# Altium schematic sheet 19-Power-P5V.SchDoc
size B; SheetNumber: 19; SheetTotal: 20; SPICEModelCacheMWNZRPGN: <root> / <DocumentId>MWNZRPGN</DocumentId> / <CacheFrame Number="0"> / <Model Name="emk105bj105_v-f" Kind="CKT"> / <Text>* EMK105BJ105_V-F     SPICE MODEL  ( General Type ) / *-------------------------------------------------------------------------------------------------------- / * Model Generated by TAIYO YUDEN Corporation (http://www.ty-top.com) / * Version 1.0 / * TAIYO YUDEN Control No. 170508_130520 / * Copyright(c) 2012 TAIYO YUDEN CO.,LTD. All Rights Reserved. / *-------------------------------------------------------------------------------------------------------- / * / * Products Name : Multilayer Ceramic Capacitors / * / * Characteristics : / *     Capacitance : 1 uF , Rated Voltage : 16V , TCC : X5R / *     Case Size : 1.0 x 0.5 / 0.039 x 0.02 [mm/inch] , Thickness : 0.5 / 0.02 [mm/inch] / *     (Conditions: Temperature = 25 degC , DC Bias Current/Voltage = 0A / 0V) / * / * Frequency Range : 40Hz - 3GHz / * / * External Node Assignments : / * / *  1  o---| |---o  2 / * / *-------------------------------------------------------------------------------------------------------- / .SubCkt EMK105BJ105_V-F 1 2 / **************************** / C0 1 110 0.68309u / Cm 1 101 0.26053u / C1 101 102 0.94076u / Rc1 101 102 1.9029k / C2 102 103 0.66707u / Rc2 102 103 120.36 / C3 103 110 0.57203u / Rc3 103 110 2.1097 / C2m 1 301 0.1871u / C21 301 302 3.2494u / Rc21 301 302 1.1117k / C22 302 303 2.1014u / Rc22 302 303 1.484k / C23 303 304 2.1172u / Rc23 303 304 1.3876k / C24 304 305 0.75729u / Rc24 304 305 332.59 / C25 305 306 0.94401u / Rc25 305 306 249.09 / C26 306 307 0.34674u / Rc26 306 307 28.352 / C27 307 308 0.37158u / Rc27 307 308 19.989 / C28 308 309 0.17933u / Rc28 308 309 31.748 / C29 309 110 0.016445u / Rc29 309 110 1.0592 / Rp0 1 110 100Meg / L0 110 120 0.2216n / Lm 120 130 0.1509n / L1 120 121 0.12659n / RL1 121 130 0.85161 / L2 120 122 0.15996n / RL2 122 130 0.42469 / L3 120 123 7.9543n / RL3 123 130 0.54643m / CR 120 124 0.24334u / LR 124 125 0.090738n / RR 125 130 68.076m / CL 130 140 2.7354p / LL 130 140 0.10762n / RL 130 140 50.614 / Rs 140 2 7.5416m / **************************** / .ends EMK105BJ105_V-F</Text> / </Model> / </CacheFrame> / </root>
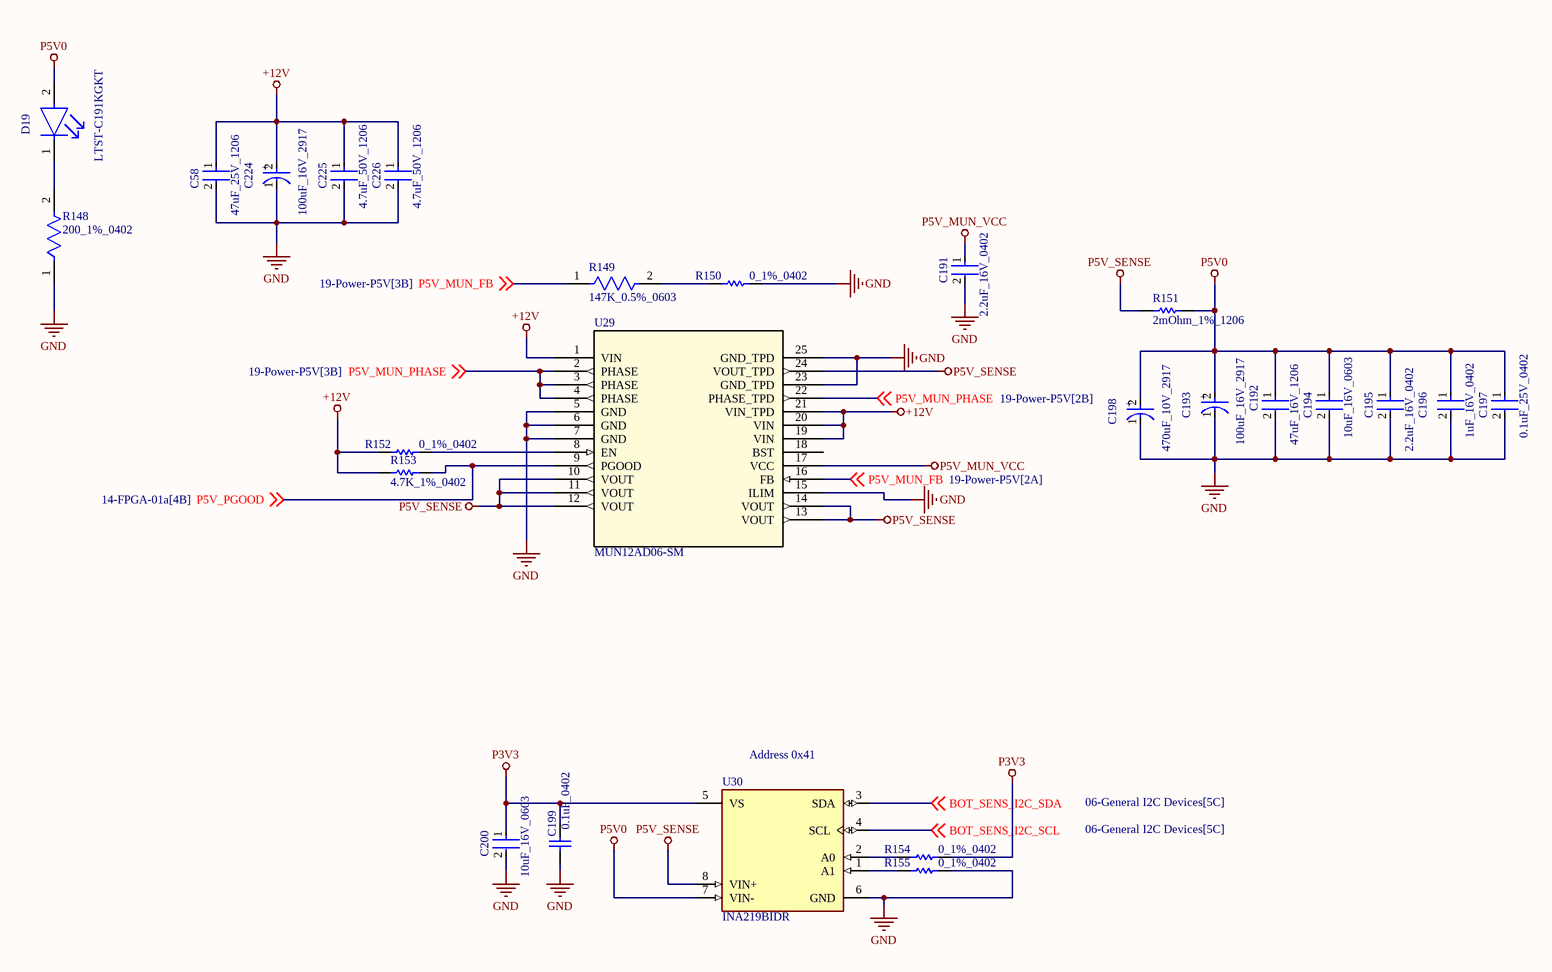
[diagram p0: 19-Power-P5V.SchDoc]

## Parts
C58  47uF_25V_1206  [FP-C3216-160-0_2-MFG]
C191  2.2uF_16V_0402  [FP-C1005-050-0_05-IPC_A]
C192  47uF_16V_1206  [FP-C3216-160-0_2-MFG]
C193  100uF_16V_2917  [FP-T495D107K016ATE125-MFG]
C194  10uF_16V_0603  [FP-0603-L_1_6_0_2-W_0_8_0-MFG]
C195  2.2uF_16V_0402  [FP-C1005-050-0_05-IPC_A]
C196  1uF_16V_0402  [FP-0402-L_1_0_0_05-W_0_5-IPC_A]
C197  0.1uF_25V_0402  [FP-0402-L_1_0_1-W_0_5_0_1-IPC_C]
C198  470uF_10V_2917  [FP-TAJE-MFG]
C199  0.1uF_0402  [CAPC1005X56X25NL10T15]
C200  10uF_16V_0603  [FP-0603-L_1_6_0_2-W_0_8_0-MFG]
C224  100uF_16V_2917  [FP-T495D107K016ATE125-MFG]
C225  4.7uF_50V_1206  [FP-GRM31C-0_2-e0_3_0_8-IPC_C]
C226  4.7uF_50V_1206  [FP-GRM31C-0_2-e0_3_0_8-IPC_C]
D19  LTST-C191KGKT  [FP-LTST-C191KGKT-MFG]
R148  200_1%_0402  [FP-ERJ2RK-IPC_A]
R149  147K_0.5%_0603  [FP-RR0816-IPC_C]
R150  0_1%_0402  [RESC1005X40X25LL05T05]
R151  2mOhm_1%_1206  [RESC3216X89X64NL25T25]
R152  0_1%_0402  [RESC1005X40X25LL05T05]
R153  4.7K_1%_0402  [RESC1005X40X25NL10T10]
R154  0_1%_0402  [RESC1005X40X25LL05T05]
R155  0_1%_0402  [RESC1005X40X25LL05T05]
U29  MUN12AD06-SM  [MUN12AD06-SM_CYN]
U30  INA219BIDR  [FP-D0008A-MFG]

## Nets
+12V: C58.1 C224.2(A) C225.1 C226.1 R152.1 R153.2 U29.1(VIN) U29.19(VIN) U29.20(VIN) U29.21(VIN_TPD)
GND: C58.2 C191.2 C192.2 C193.1(C) C194.2 C195.2 C196.2 C197.2 C198.1(C) C199.1 C200.2 C224.1(C) C225.2 C226.2 R148.1 R150.2 R155.2 U29.5(GND) U29.6(GND) U29.7(GND) U29.15(ILIM) U29.23(GND_TPD) U29.25(GND_TPD) U30.6(GND)
P3V3: C199.2 C200.1 R154.2 U30.5(VS)
P5V0: C192.1 C193.2(A) C194.1 C195.1 C196.1 C197.1 C198.2(A) D19.2(A) R151.2 U30.7(VIN-)
P5V_MUN_VCC: C191.1 U29.17(VCC)
P5V_SENSE: R151.1 U29.10(VOUT) U29.11(VOUT) U29.12(VOUT) U29.13(VOUT) U29.14(VOUT) U29.24(VOUT_TPD) U30.8(VIN+)
BOT_SENS_I2C_SCL: U30.4(SCL) ; off-sheet BOT_SENS_I2C_SCL
BOT_SENS_I2C_SDA: U30.3(SDA) ; off-sheet BOT_SENS_I2C_SDA
P5V_MUN_FB: R149.1 U29.16(FB) ; off-sheet P5V_MUN_FB
P5V_MUN_PHASE: U29.2(PHASE) U29.3(PHASE) U29.4(PHASE) U29.22(PHASE_TPD) ; off-sheet P5V_MUN_PHASE
P5V_PGOOD: R153.1 U29.9(PGOOD) ; off-sheet P5V_PGOOD
NetD19_1: D19.1(C) R148.2
NetR149_2: R149.2 R150.1
NetR152_2: R152.2 U29.8(EN)
NetR154_1: R154.1 U30.2(A0)
NetR155_1: R155.1 U30.1(A1)

Not connected (* = marked no-connect by the designer): U29 18(BST)

## Notes on the sheet
- (near U30) Address 0x41
- (in symbol CMP-2000-07207-2) +
- (in symbol CMP-04424-000243-1) +

## Library data of the parts
C58 = CMP-2000-05397-3: Multilayer Ceramic Capacitors 47uF ±20% 25V X5R SMD 1206; Weight: 0.000571oz; Dielectric: X5R; Length: 0.126inch; Voltage Rating: 25V; Case/Package: 1206; Dielectric Material: Ceramic; Min Operating Temperature: -55°C; Lead Free: Lead Free; Packaging: Tape and Reel; Package Quantity: 1; Mount: Surface Mount; Depth: 1.6mm; REACH SVHC: No SVHC; Termination: SMD/SMT; Case Code (Imperial): 1206; Series: C; Resistor Type: Ceramic; Voltage: 25V; Width: 0.063inch; Height: 1.6mm; Tolerance: 20%; Capacitance: 47uF; Max Operating Temperature: 85°C; Voltage Rating (DC): 25V; RoHS Compliant: Yes; Thickness: 0.071inch; Case Code (Metric): 3216
C191 C195 = CMP-2000-05998-2: Multilayer Ceramic Capacitors 2.2μF ±10% 16V X5R SMD 0402; Capacitance: 2.2uF; REACH SVHC: No SVHC; Series: C; Termination: SMD/SMT; Case Code (Imperial): 0402; Depth: 0.5mm; Mount: Surface Mount; Width: 0.02inch; Package Quantity: 1; Dielectric Material: Ceramic; Length: 1mm; Packaging: Tape and Reel; Case Code (Metric): 1005; RoHS Compliant: Yes; Dielectric: X5R; Max Operating Temperature: 85°C; Lead Free: Lead Free; Weight: 2.3E-05oz; Thickness: 0.022inch; Voltage Rating (DC): 16V; Tolerance: 10%; Voltage Rating: 16V; Resistor Type: Ceramic; Height: 0.5mm; Case/Package: 0402; Min Operating Temperature: -55°C
C192 = CMP-2000-07442-2: Multilayer Ceramic Capacitors 47uF ±20% 16V X5R SMD 1206; Resistor Type: Ceramic; Width: 0.063inch; Case Code (Imperial): 1206; Radiation Hardening: No; Thickness: 0.071inch; Dielectric: X5R; Weight: 0.000571oz; Termination: SMD/SMT; Dielectric Material: Ceramic; Min Operating Temperature: -55°C; Depth: 1.6mm; Case Code (Metric): 3216; Max Operating Temperature: 85°C; RoHS Compliant: Yes; REACH SVHC: No SVHC; Mount: Surface Mount; Lead Free: Lead Free; Height: 1.6mm; Length: 3.2mm; Tolerance: 20%; Voltage Rating (DC): 16V; Capacitance: 47uF; Package Quantity: 1; Construction: Flat; Packaging: Tape and Reel; Series: C; Case/Package: 1206; Voltage Rating: 16V
C193 C224 = CMP-2000-07207-2: CAP TANT 100UF 10% 16V 2917; Life (Hours): 2000Hour; ESR (Equivalent Series Resistance): 125mR; Polarity: Polar; Dielectric Material: Tantalum; Dissipation Factor: 8%; Capacitance: 100uF; Radiation Hardening: No; RoHS Compliant: Yes; Length: 7.3mm; Features: General Purpose; Packaging: Tape and Reel; Package Quantity: 1; Weight: 0.023634oz; Voltage Rating: 16V; Width: 0.169inch; Case/Package: 2917; Mount: Surface Mount; Voltage: 16V; Min Operating Temperature: -55°C; Tolerance: 10%; REACH SVHC: No SVHC; Height - Seated (Max): 0.122inch; Number of Pins: 2; Construction: Flat; Depth: 4.3mm; Series: T495; Max Operating Temperature: 125°C; Failure Rate: 0.001%; Termination: SMD/SMT; Voltage Rating (DC): 16V; Case Code (Imperial): 2917; Case Code (Metric): 7343; Height: 2.8mm
C194 C200 = CMP-2000-06226-4: Multilayer Ceramic Capacitor 10uF 16V X5R 20% SMD 0603 T/R; Packaging: Tape and Reel; Construction: Flat; Height: 0.8mm; Max Operating Temperature: 85°C; Dielectric: X5R; Case Code (Metric): 1608; Voltage Rating (DC): 16V; Width: 0.031inch; Voltage Rating: 16V; Length: 0.063inch; RoHS Compliant: Yes; Halogen Free: Halogen Free; Case Code (Imperial): 0603; Capacitance: 10uF; Mount: Surface Mount; Thickness: 0.031inch; Tolerance: 20%; Min Operating Temperature: -55°C; Series: M; Termination: SMD/SMT; Case/Package: 0603; Package Quantity: 1
C196 = CMP-14477-000104-2: None; Tolerance: 10%; Voltage Rating: 16V; Dielectric: X5R; Capacitance: 1uF; Packaging: Tape and Reel; Depth: 0.5mm; Mount: Surface Mount; Thickness: 0.022inch; Package Quantity: 1; Min Operating Temperature: -55°C; Series: M; Voltage Rating (DC): 16V; Termination: SMD/SMT; Case/Package: 0402; Number of Pins: 2; Case Code (Imperial): 0402; Length: 1mm; Halogen Free: Halogen Free; Case Code (Metric): 1005; Width: 0.02inch; RoHS Compliant: Yes; Radiation Hardening: No; Max Operating Temperature: 85°C; Height: 0.5mm; Construction: Flat
C197 = CMP-2008-02519-2: General Purpose Ceramic Capacitor, 0402, 100nF, 10%, X7R, 15%, 25V; Package Quantity: 1; Capacitance: 100nF; Min Operating Temperature: -55°C; Voltage: 25V; Voltage Rating: 25V; Construction: Flat; Max Operating Temperature: 125°C; Radiation Hardening: No; Depth: 0.5mm; Thickness: 0.022inch; Voltage Rating (DC): 25V; Number of Pins: 2; Lead Free: Lead Free; Series: -; REACH SVHC: No SVHC; Length: 1mm; Dielectric: X7R; RoHS Compliant: Yes; Mount: Surface Mount; Packaging: Tape and Reel; Case/Package: 0402; Case Code (Imperial): 0402; Termination: SMD/SMT; Width: 0.02inch; Case Code (Metric): 1005; Tolerance: 10%
C198 = CMP-04424-000243-1: 470uF 10V  ±10% 500mΩ 2917  SMD Tantalum Capacitor; Leakage Current: 47uA; ESR (Equivalent Series Resistance): 500mR; Polarity: Polar; Construction: Flat; Width: 4.3mm; Mount: Surface Mount; Tolerance: 10%; Max Operating Temperature: 125°C; Min Operating Temperature: -55°C; Length: 7.3mm; Voltage: 10V; Dissipation Factor: 10%; REACH SVHC: No SVHC; Lead Free: Lead Free; Case/Package: 2917; Voltage Rating: 10V; Capacitance: 470uF; Series: TAJ; Height: 4.1mm; RoHS Compliant: Yes; Packaging: Tape and Reel; Voltage Rating (DC): 10V; Radiation Hardening: No; Dielectric Material: Tantalum; Number of Pins: 2; Depth: 4.3mm; Case Code (Metric): 7343; Case Code (Imperial): 2917; Termination: SMD/SMT; Lead Pitch: 4.4mm; Features: General Purpose; Height - Seated (Max): 0.169inch; Package Quantity: 1
C199 = CMP-2008-00031-1: Part Number: LD02YD104KAB2A; Manufacturer: AVX Interconnect / Elco
C225 C226 = CMP-1037-04923-3: Chip Multilayer Ceramic Capacitors for General Purpose, 1206, 4.7uF, X7R, 15%, 10%, 50V; Height: 1.6mm; Voltage: 50V; Capacitance: 4.7uF; Lead Free: Lead Free; Max Operating Temperature: 125°C; Packaging: Tape and Reel; REACH SVHC: No SVHC; Voltage Rating: 50V; Mount: Surface Mount; Termination: SMD/SMT; Tolerance: 10%; Case/Package: 1206; Material: Ceramic; Depth: 1.6mm; Length: 3.2mm; Case Code (Metric): 3216; Voltage Rating (DC): 50V; Case Code (Imperial): 1206; Radiation Hardening: No; Width: 0.063inch; Thickness: 0.071inch; Package Quantity: 2000; Min Operating Temperature: -55°C; Dielectric: X7R
D19 = CMP-2000-05198-2: LED GREEN CLEAR SMD; Max Power Dissipation: 75mW; Forward Current: 30mA; Reverse Voltage: 5V; Lens Color: Colorless; Forward Voltage: 2V; Dominant Wavelength: 571nm; Number of LEDs: 1; Viewing Angle: 130°; Lens Style: Rectangular; Test Current: 20mA; Luminous Intensity: 35mcd; Wavelength: 574nm; Width: 0.8mm; Case Code (Imperial): 0603; Number of Pins: 2; Lead Free: Lead Free; Packaging: Tape and Reel; Package Quantity: 1; Min Operating Temperature: -55°C; Case/Package: 0603; Length: 1.6mm; Power Dissipation: 75mW; Depth: 0.8mm; Radiation Hardening: No; Mount: Surface Mount; Max Operating Temperature: 85°C; Color: Green; Power Rating: 75mW; Height: 0.55mm; Illumination Color: Green; Case Code (Metric): 1608; Lens Transparency: Clear; Number of Elements: 1
R148 = CMP-2002-00757-2: RES SMD 200 OHM 1% 1/10W 0402; Power Rating: 100mW; Voltage Rating (DC): 50V; Resistance: 200R; Temperature Coefficient: 100ppm/°C; RoHS Compliant: Yes; Packaging: Tape and Reel; Case Code (Metric): 1005; Package Quantity: 1; Contact Plating: Tin; Series: ERJ; Mount: Surface Mount; Lead Free: Lead Free; Min Operating Temperature: -55°C; Number of Terminations: 2; Max Power Dissipation: 100mW; Technology: THICK FILM; Voltage Rating: 50V; Case/Package: 0402; Width: 0.02inch; Termination: SMD/SMT; Military Standard: Not; Height: 0.35mm; Radiation Hardening: No; Resistance Tolerance: 1%; Length: 1mm; REACH SVHC: No SVHC; Construction: Rectangular; Depth: 0.5mm; Features: Automotive AEC-Q200; Resistor Type: Thick Film; Case Code (Imperial): 0402; Tolerance: 1%; Size Code: 0402; Max Operating Temperature: 155°C
R149 = CMP-28537-013021-1: 147kΩ ±0.5% 0.0625W 1/16W Chip Resistor 0603 (1608 Metric) Thin Film; Voltage Rating (DC): 75V; Resistance: 147kR; Power Rating: 62.5mW; Temperature Coefficient: 25ppm/°C; Max Power Dissipation: 63mW; Width: 0.031inch; Termination: SMD/SMT; RoHS Compliant: Yes; Length: 0.063inch; Tolerance: 0.5%; Case Code (Imperial): 0603; Packaging: Tape and Reel; Lead Free: Lead Free; Case/Package: 0603; Weight: 7.1E-05oz; Series: RR; Max Operating Temperature: 125°C; Number of Terminations: 2; Package Quantity: 1; Case Code (Metric): 1608; Resistor Type: Thin Film; Voltage Rating: 75V; Height: 0.02inch; Min Operating Temperature: -55°C
R150 R152 R154 R155 = CMP-2000-07451-1: Chip Resistor, 0 Ohm, 0.1 W, -55 to 155 degC, 0402 (1005 Metric), RoHS, Tape and Reel; Manufacturer: Panasonic; Voltage Rating (DC): 50V; Temperature Coefficient: 600ppm/��C; Max Power Dissipation: 100mW; Resistance: 0mOhm; Tolerance: 5%; Number of Terminations: 2; Mount: SurfaceMount; Height: 0.35mm; Packaging: TapeandReel; Contact Plating: Tin; Manufacturer URL: http://www.panasonic.com/; Composition: ThickFilm; Max Operating Temperature: 155degC; REACH SVHC: NoSVHC; Case/Package: 0402; Package Reference: 402; Depth: 0.5mm; Package Description: 2-Pin Surface Mount Device, Body 1 x 0.5 mm; Datasheet URL: https://industrial.panasonic.com/cdbs/www-data/pdf/RDA0000/AOA0000C301.pdf; RoHSCompliant: True; Case Code (Imperial): 0402; Military Standard: Not; Min Operating Temperature: -55degC; Power Rating: 100mW; Datasheet Version: 03/2015; Length: 1mm; Case Code (Metric): 1005; Termination: SMD/SMT; Mounting Technology: SurfaceMount; Voltage Rating: 50V; Width: 0.02inch; Package Quantity: 1; Lead Free: LeadFree; Radiation Hardening: No
R151 = CMP-2003-04334-1: Manufacturer: Vishay Dale; Part Number: WSL12062L000FEA18
R153 = CMP-2002-05217-1: Manufacturer: Bourns; Part Number: CR0402-FX-4701GLF
U29 = MUN12AD06-SM: No Description Available; Mfr_Name: Cyntec; RefDes: RefDes; Type: Type
U30 = CMP-0704-00005-3: IC MONITOR PWR/CURR BIDIR 8-SOIC; Min Supply Voltage: 3V; Common Mode Rejection Ratio: 100dB; Output Current: 10mA; Number of Amplifiers: 1; Accuracy: 0.5%; Supply Current: 1mA; Quiescent Current: 700uA; Bandwidth: 11kHz; Input Offset Voltage (Vos): 40uV; Max Supply Voltage: 5.5V; Packaging: Tape and Reel; REACH SVHC: No SVHC; Max Operating Temperature: 125°C; Number of Pins: 8; Lead Free: Lead Free; Package Quantity: 1; Radiation Hardening: No; Case/Package: SOIC; Min Operating Temperature: -40°C; Contact Plating: Gold; Series: Zero-Drift; Nominal Supply Current: 1mA; RoHS Compliant: Yes